# EAGLE design test (EAGLE 5.06)
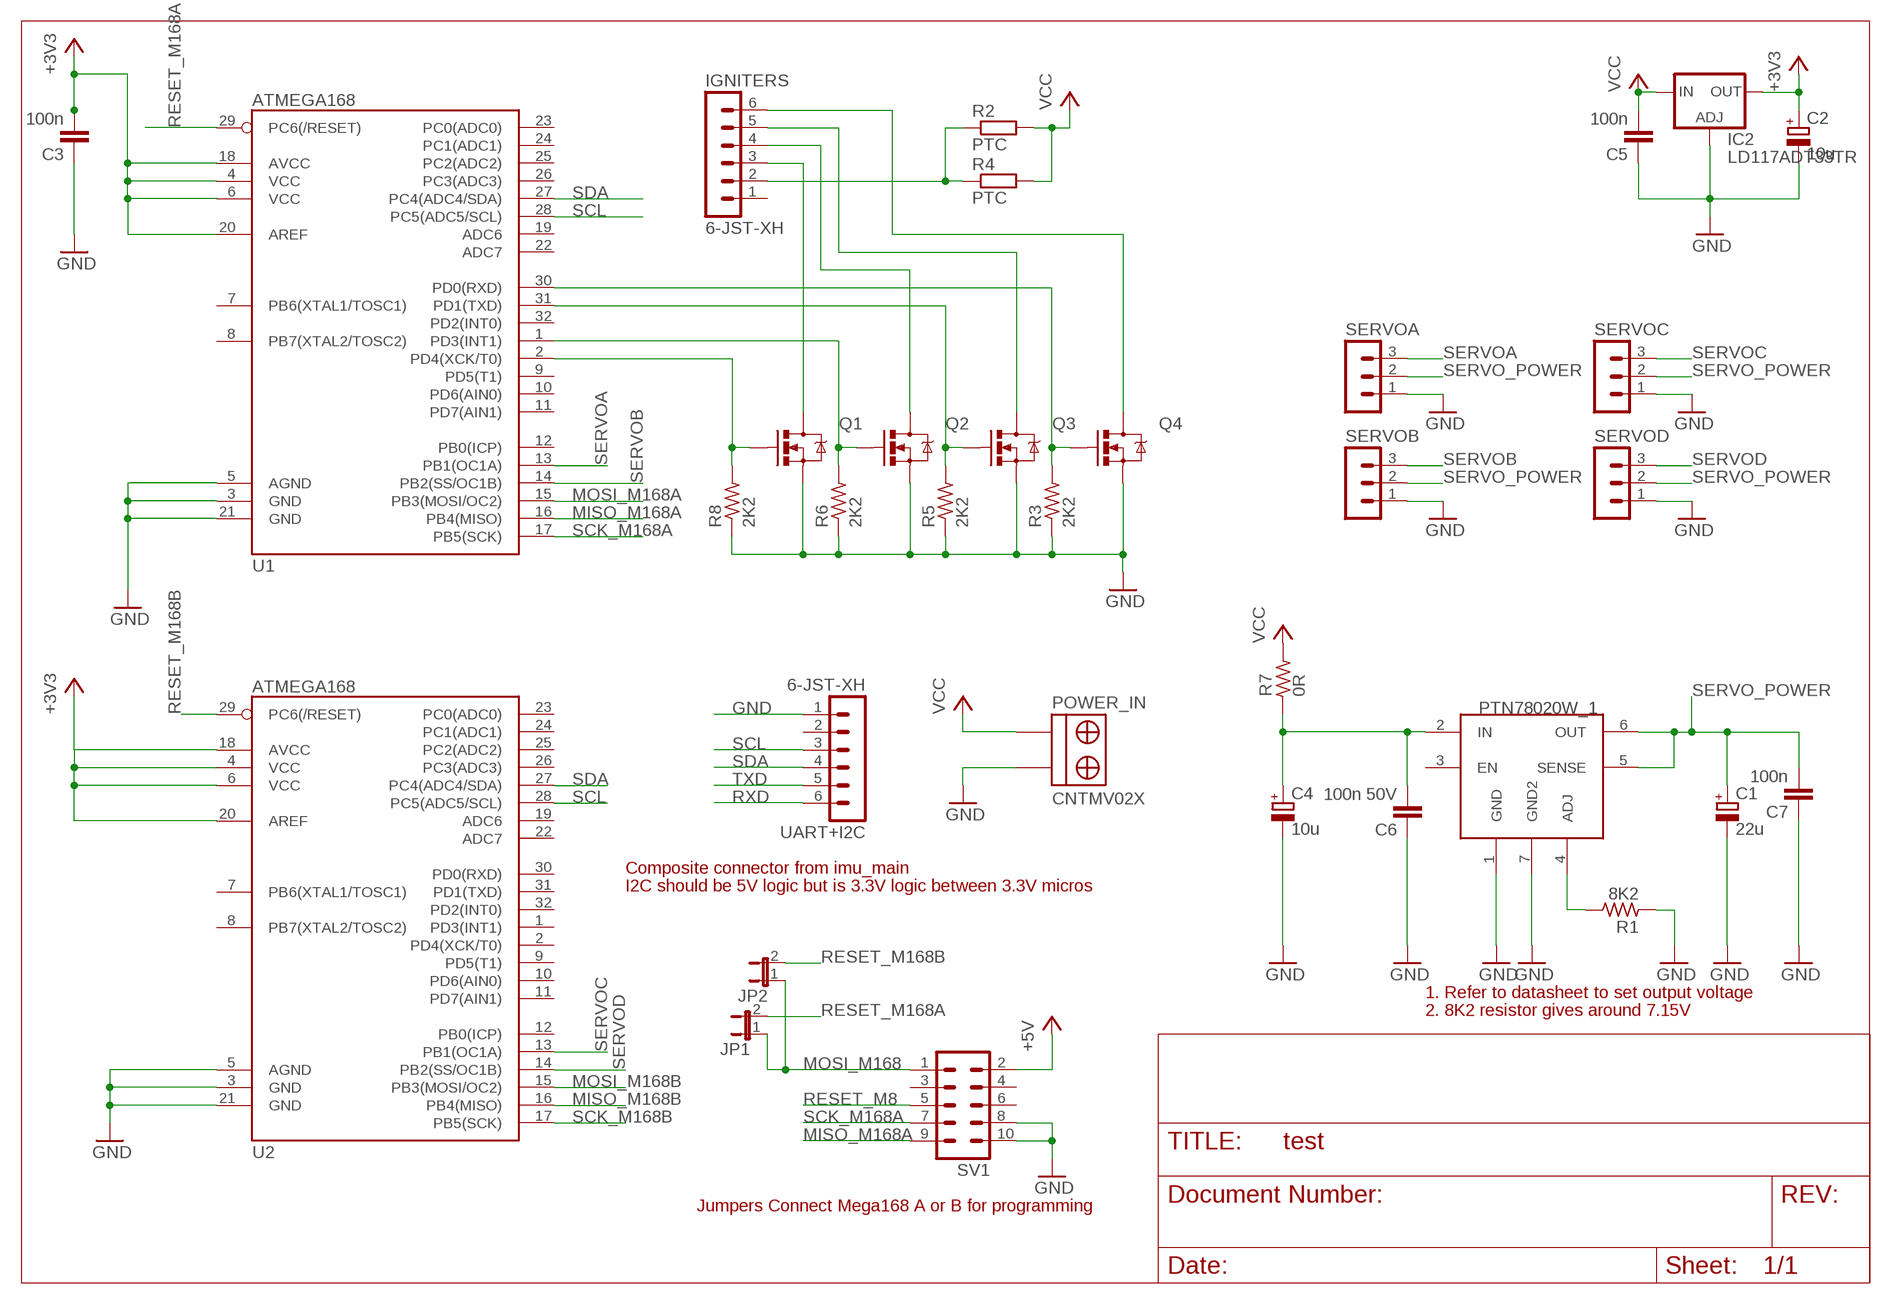
[diagram p0: schematic, sheet 1]

## Parts
C1  22u  CPOL-EUC/6032-28R  [C/6032-28R]
C2  10u  CPOL-EUC/6032-28R  [C/6032-28R]
C3  100n  C-EUC0805  [C0805]
C4  10u  CPOL-EUC/6032-28R  [C/6032-28R]
C5  100n  C-EUC0805  [C0805]
C6  100n 50V  C-EUC3216  [C3216]
C7  100n  C-EUC3216  [C3216]
IC2  LD117ADT33TR  [DPACK]
IGNITERS  6-JST-XH  [6]
JP1  JP1E  [JP1]
JP2  JP1E  [JP1]
POWER_IN  CNTMV02X  [CNTMV02X]
PTN78020W_1  PTN78020  [PTN78020]
Q1  MOSFET-NCHANNELSMD  [SOT23-3]
Q2  MOSFET-NCHANNELSMD  [SOT23-3]
Q3  MOSFET-NCHANNELSMD  [SOT23-3]
Q4  MOSFET-NCHANNELSMD  [SOT23-3]
R1  8K2  R_2012  [R2012]
R2  PTC  R-EU_R2512  [R2512]
R3  2K2  R-US_R0805  [R0805]
R4  PTC  R-EU_R2512  [R2512]
R5  2K2  R-US_R0805  [R0805]
R6  2K2  R-US_R0805  [R0805]
R7  0R  R_2512  [R2512]
R8  2K2  R-US_R0805  [R0805]
SERVOA  MA03-1  [MA03-1]
SERVOB  MA03-1  [MA03-1]
SERVOC  MA03-1  [MA03-1]
SERVOD  MA03-1  [MA03-1]
SV1  MA05-2LARGE_PAD  [MA05-2A]
U1  ATMEGA168  [TQFP32-08]
U2  ATMEGA168  [TQFP32-08]
UART+I2C  6-JST-XH  [6]

## Nets
+3V3: C2.+ C3.2 IC2.4(OUT) U1.4(VCC) U1.6(VCC) U1.18(AVCC) U1.20(AREF) U2.4(VCC) U2.6(VCC) U2.18(AVCC) U2.20(AREF)
+5V: SV1.2
GND: C1.- C2.- C3.1 C4.- C5.1 C6.1 C7.1 IC2.1(ADJ) POWER_IN.1(+) PTN78020W_1.1(GND) PTN78020W_1.7(GND2) Q1.2(S) Q2.2(S) Q3.2(S) Q4.2(S) R1.1 R3.1 R5.1 R6.1 R8.1 SERVOA.1 SERVOB.1 SERVOC.1 SERVOD.1 SV1.8 SV1.10 U1.3(GND) U1.5(AGND) U1.21(GND) U2.3(GND) U2.5(AGND) U2.21(GND) UART+I2C.1
MISO_M168A: SV1.9 U1.16(PB4(MISO))
MISO_M168B: U2.16(PB4(MISO))
MOSI_M168: JP1.1 JP2.1 SV1.1
MOSI_M168A: U1.15(PB3(MOSI/OC2))
MOSI_M168B: U2.15(PB3(MOSI/OC2))
N$1: IGNITERS.4 Q2.3(D)
N$2: IGNITERS.3 Q1.3(D)
N$3: IGNITERS.5 Q3.3(D)
N$4: IGNITERS.2 R2.1 R4.1
N$5: IGNITERS.6 Q4.3(D)
N$6: Q1.1(G) R8.2 U1.2(PD4(XCK/T0))
N$7: Q2.1(G) R6.2 U1.1(PD3(INT1))
N$8: Q3.1(G) R5.2 U1.31(PD1(TXD))
N$9: Q4.1(G) R3.2 U1.30(PD0(RXD))
N$10: PTN78020W_1.4(ADJ) R1.2
N$11: C4.+ C6.2 PTN78020W_1.2(IN) R7.1
RESET_M8: SV1.5
RESET_M168A: JP1.2 U1.29(PC6(/RESET))
RESET_M168B: JP2.2 U2.29(PC6(/RESET))
RXD: UART+I2C.6
SCK_M168A: SV1.7 U1.17(PB5(SCK))
SCK_M168B: U2.17(PB5(SCK))
SCL: U1.28(PC5(ADC5/SCL)) U2.28(PC5(ADC5/SCL)) UART+I2C.3
SDA: U1.27(PC4(ADC4/SDA)) U2.27(PC4(ADC4/SDA)) UART+I2C.4
SERVO_POWER: C1.+ C7.2 PTN78020W_1.5(SENSE) PTN78020W_1.6(OUT) SERVOA.2 SERVOB.2 SERVOC.2 SERVOD.2
SERVOA: SERVOA.3 U1.13(PB1(OC1A))
SERVOB: SERVOB.3 U1.14(PB2(SS/OC1B))
SERVOC: SERVOC.3 U2.13(PB1(OC1A))
SERVOD: SERVOD.3 U2.14(PB2(SS/OC1B))
TXD: UART+I2C.5
VCC: C5.2 IC2.3(IN) POWER_IN.2(-) R2.2 R4.2 R7.2
Unconnected: IGNITERS.1 PTN78020W_1.3(EN) SV1.3 SV1.4 SV1.6 U1.7(PB6(XTAL1/TOSC1)) U1.8(PB7(XTAL2/TOSC2)) U1.9(PD5(T1)) U1.10(PD6(AIN0)) U1.11(PD7(AIN1)) U1.12(PB0(ICP)) U1.19(ADC6) U1.22(ADC7) U1.23(PC0(ADC0)) U1.24(PC1(ADC1)) U1.25(PC2(ADC2)) U1.26(PC3(ADC3)) U1.32(PD2(INT0)) U2.1(PD3(INT1)) U2.2(PD4(XCK/T0)) U2.7(PB6(XTAL1/TOSC1)) U2.8(PB7(XTAL2/TOSC2)) U2.9(PD5(T1)) U2.10(PD6(AIN0)) U2.11(PD7(AIN1)) U2.12(PB0(ICP)) U2.19(ADC6) U2.22(ADC7) U2.23(PC0(ADC0)) U2.24(PC1(ADC1)) U2.25(PC2(ADC2)) U2.26(PC3(ADC3)) U2.30(PD0(RXD)) U2.31(PD1(TXD)) U2.32(PD2(INT0)) UART+I2C.2

## Notes on the sheet
- Composite connector from imu_main
- I2C should be 5V logic but is 3.3V logic between 3.3V micros
- 1. Refer to datasheet to set output voltage
- 2. 8K2 resistor gives around 7.15V
- Jumpers Connect Mega168 A or B for programming

## Library data of the parts
C1 C2 C4 = rcl:CPOL-EU: POLARIZED CAPACITOR, European symbol
C3 C5-C7 = rcl:C-EU: CAPACITOR, European symbol
IC2 = v-reg:LD117A?*: Low drop fixed and adjustable positive voltage regulators 1 A Source: http://www.st.com/stonline/products/literature/ds/7194/ld1117axx.pdf
IGNITERS UART+I2C = con-jst-xh:6-JST-XH
JP1 JP2 = jumper:JP1E: JUMPER
POWER_IN = robert-custom:CNTMV02X
PTN78020W_1 = robert-custom:PTN78020
Q1-Q4 = SparkFun:MOSFET-NCHANNEL
R1 R7 = rc-master-smd:R_: RESISTOR
R2 R4 = rcl:R-EU_: RESISTOR, European symbol
R3 R5 R6 R8 = rcl:R-US_: RESISTOR, American symbol
SERVOA SERVOB SERVOC SERVOD = con-lstb:MA03-1: PIN HEADER
SV1 = con-lstb:MA05-2: PIN HEADER
U1 U2 = SparkFun:ATMEGA168

## Board
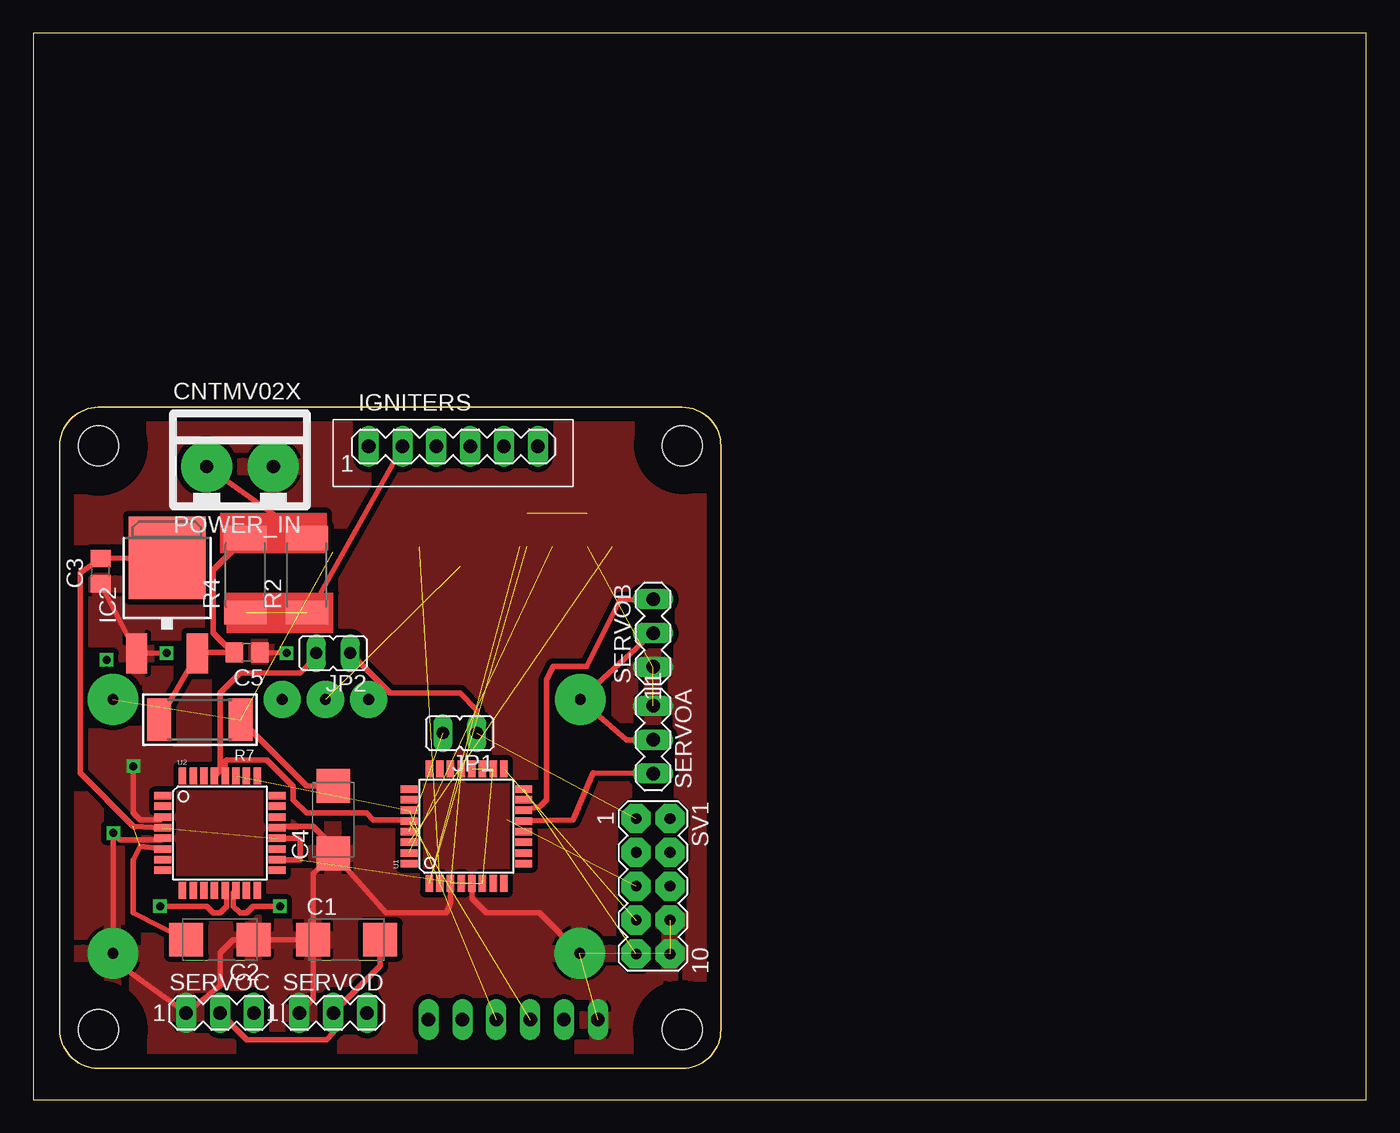
[diagram p1: board, top side]
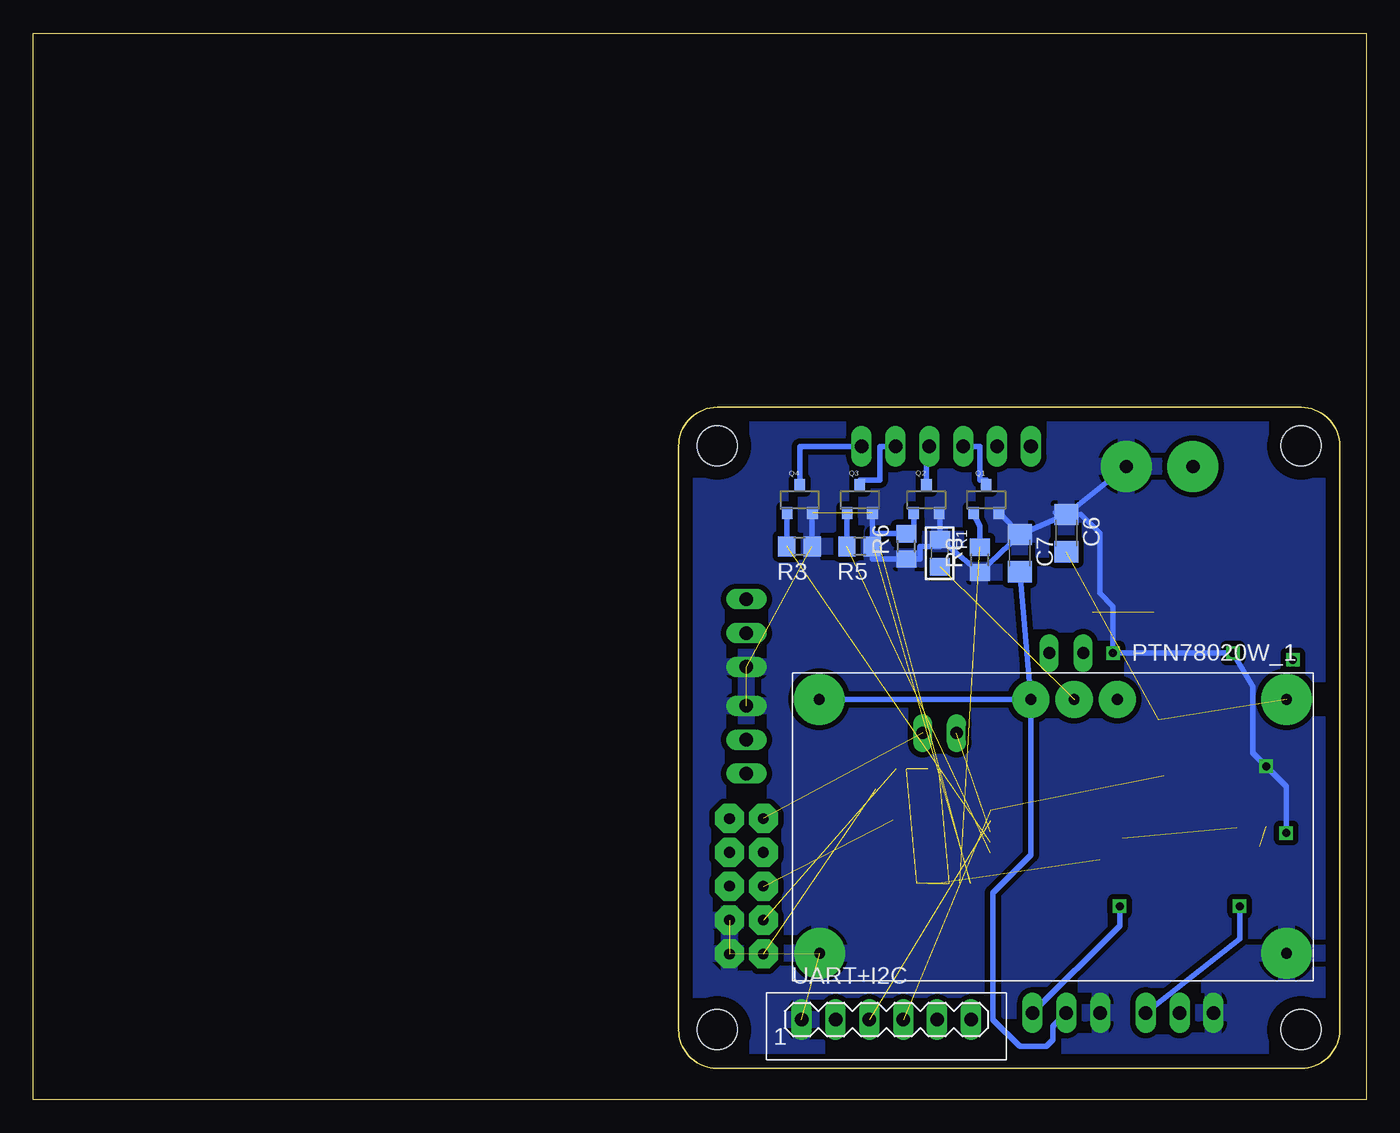
[diagram p2: board, bottom side, seen from below]

Size 100 x 80 mm. Coordinates in mm from the lower left corner, seen from the top.
Outline: 0,0 100,0 100,80 0,80 0,0
Outline: 1.99,5.24 1.99,49.04 arc-90 4.89,51.94 48.69,51.94 arc-90 51.59,49.04 51.59,5.24 arc-90 48.69,2.34 4.89,2.34 arc-90 1.99,5.24
Copper layers (1*16): Top 0.035mm / dielectric 1.5mm / Bottom 0.035mm
Design rules "default": minimum track width 10mil, minimum drill 24mil, track to track 8mil, track to pad 8mil, pad to pad 8mil, via to via 8mil, smd to smd 8mil, copper to edge 40mil, drill to drill 8mil, minimum pad ring 10mil, minimum via ring 8mil, stop-mask expansion 4mil, vias tented up to drill 0mil, thermal gap 10mil
Holes 3 mm at 4.89,49.04 48.69,49.04 4.89,5.24 48.69,5.24
tRestrict: area 1.8,45.9 to 8,52.1; area 45.7,46 to 51.9,52.2; area 45.6,2.1 to 51.8,8.3; area 1.8,2.1 to 8,8.3

### Footprints (pad centres in the part's own frame; a part is rotated, then mirrored left to right if it is on the bottom)
C/6032-28R = smd 2.55 x 2.5: + 2.525,0; - -2.525,0
C0805 = smd 1.3 x 1.5: 1 -0.95,0; 2 0.95,0
C3216 = smd 1.6 x 1.8: 1 -1.4,0; 2 1.4,0
DPACK = smd 1.6 x 3: 1 -2.28,-4.8; 3 2.28,-4.8 | smd 5.8 x 6.2: 4 0,2.38
6 = drill 1.016 long: 1 -6.35,0; 2 -3.81,0; 3 -1.27,0; 4 1.27,0; 5 3.81,0; 6 6.35,0
JP1 = drill 0.914 long: 1 0,-1.27; 2 0,1.27
CNTMV02X = drill 1 pad 3.81 round: 1 2.5,0; 2 -2.5,0
PTN78020 = drill 0.8 pad 3.81 round: 1 -17.526,9.525; 2 -17.526,-9.525; 6 17.531,-9.525; 7 17.499,9.525 | drill 0.8 pad 2.794 round: 3 -4.831,-9.525; 4 -1.587,-9.525; 5 1.656,-9.525
SOT23-3 = smd 0.8 x 0.9: 1 -0.95,-1; 2 0.95,-1; 3 0,1.1
R2012 = smd 1.3 x 1.5: 1 -1.016,0; 2 1.016,0
R2512 = smd 1.8 x 3.2: 1 -2.8,0; 2 2.8,0
R0805 = smd 1.3 x 1.5: 1 -0.95,0; 2 0.95,0
R2512' = smd 1.8 x 3.2: 1 -3.048,0; 2 3.048,0
MA03-1 = drill 1.016 long: 1 -2.54,0; 2 0,0; 3 2.54,0
MA05-2A = drill 0.8 pad 2.184 octagon: 1 -5.08,-1.27; 2 -5.08,1.27; 3 -2.54,-1.27; 4 -2.54,1.27; 5 0,-1.27; 6 0,1.27; 7 2.54,-1.27; 8 2.54,1.27; 9 5.08,-1.27; 10 5.08,1.27
TQFP32-08 = smd 1.27 x 0.559: 1 -4.293,2.8; 2 -4.293,2; 3 -4.293,1.2; 4 -4.293,0.4; 5 -4.293,-0.4; 6 -4.293,-1.2; 7 -4.293,-2; 8 -4.293,-2.8; 17 4.293,-2.8; 18 4.293,-2; 19 4.293,-1.2; 20 4.293,-0.4; 21 4.293,0.4; 22 4.293,1.2; 23 4.293,2; 24 4.293,2.8 | smd 0.559 x 1.27: 9 -2.8,-4.293; 10 -2,-4.293; 11 -1.2,-4.293; 12 -0.4,-4.293; 13 0.4,-4.293; 14 1.2,-4.293; 15 2,-4.293; 16 2.8,-4.293; 25 2.8,4.293; 26 2,4.293; 27 1.2,4.293; 28 0.4,4.293; 29 -0.4,4.293; 30 -1.2,4.293; 31 -2,4.293; 32 -2.8,4.293

### Placement (x,y rotation side)
C1  23.5,12 0 top
C2  14,12 180 top
C3  5.04,39.64 90 top
C4  22.5,21 90 top
C5  16.04,33.55 180 top
C6  22.5,42.5 270 bottom
C7  26,41 270 bottom
IC2  10.04,38.28 0 top
IGNITERS  31.51,49 0 top
JP1  32,27.5 90 top
JP2  22.5,33.5 90 top
POWER_IN  15.5,47.5 0 top
PTN78020W_1  23.5,20.5 180 bottom
Q1  28.51,45 0 bottom
Q2  32.99,45 0 bottom
Q3  37.99,45 0 bottom
Q4  42.5,45 0 bottom
R1  32,41 270 bottom
R2  20.53,39.34 90 top
R3  42.52,41.5 180 bottom
R4  15.92,39.34 90 top
R5  38,41.51 180 bottom
R6  34.5,41.51 90 bottom
R7  0R  [R2512']  12.5,28.5 180 top
R8  28.99,40.5 90 bottom
SERVOA  46.5,27 270 top
SERVOB  46.5,35 90 top
SERVOC  14,6.5 0 top
SERVOD  22.5,6.5 0 top
SV1  46.5,16 270 top
U1  32.5,20.5 90 top
U2  14,20 0 top
UART+I2C  36,6 0 bottom

### Tracks (layer width: path | path; a pad name or v marks a point on that pad's centre or on a via)
+3V3  (6 unrouted)
  Top 0.406: U2.6 8,19 7.5,18 7.5,14 C2.+ | U2.4 7.5,20.5 3.5,24.5 3.5,39.5 C3.2 IC2.4 8,39 | U2.18 20,18 20,19.5 19.9,19.6 U2.20
GND  (via drill 0.6)  (11 unrouted)
  Top 0.406: C3.1 IC2.1 10,33.5 | C5.1 19,33.5 | U2.3 9.51,21 8,21 7.5,21.5 v7.5,25 | U2.5 9.61,19.5 6.5,19.5 6,20 6,11 PTN78020W_1.1 5.97,10.49 SERVOC.1 14,8.54 14,11 15,12 16.5,12 | 16.5,12 C2.- | 16.5,12 C1.- | C4.- 20.98,16.95 C1.- | U2.21 18.39,20.5 21,20.5 22.5,19 C4.- | C4.- 26.48,14 31,14 31.3,14.8 U1.3 | PTN78020W_1.7 37.97,14 34,14 32.9,15.1 U1.5 | SERVOD.1 20.98,7.51 C1.-
  Bottom 0.406: Q1.2 27.5,44 C7.1 | Q4.2 41.57,43.99 R3.1 | Q3.2 37.05,44 R5.1 37.05,40.56 R6.1 33.5,40.56 33.5,41.5 32,41.5 R1.1 | Q2.2 32,44 R1.1 | C6.1 C7.1 | C6.1 POWER_IN.1 | R1.1 R8.1 C7.1 | C6.1 23.31,44.05 | 6,20 6,23.5 v7.5,25 8.5,26 8.5,31 10,33.5 19,33.5 19,37 20,38 20,42.5 21.4,43.9 C6.1
  pour Top (isolate 0.406): 2.5,3 51,3 51,51.5 2.5,51.5
  pour Bottom (isolate 0.406): 3,3 51,3 51,51.5 2.5,51.5 2.5,3
MISO_M168A  (1 unrouted)
MOSI_M168  (1 unrouted)
  Top 0.406: JP2.1 26.77,30.5 32,30.5 33.27,29.23 JP1.1
N$1
  Bottom 0.406: IGNITERS.4 32.99,49 Q2.3
N$2
  Bottom 0.406: IGNITERS.3 29,49 29,46.5 28.5,46.5 Q1.3
N$3
  Bottom 0.406: IGNITERS.5 36.5,49 36.5,46.5 37.99,46.5 Q3.3
N$4  (1 unrouted)
  Top 0.406: R2.1 21,37 IGNITERS.2
N$5
  Bottom 0.406: IGNITERS.6 42.5,49 Q4.3
N$6  (1 unrouted)
  Bottom 0.406: R8.2 29,43 Q1.1
N$7  (2 unrouted)
  Bottom 0.406: Q2.1 33.94,42.46 R6.2 37,42.46 37,41.5
N$8  (1 unrouted)
  Bottom 0.406: Q3.1 38.95,44 R5.2
N$9  (1 unrouted)
  Bottom 0.406: Q4.1 43.47,43.99 R3.2
N$10  (1 unrouted)
N$11  (2 unrouted)
  Top 0.406: R7.1 20.52,23.52 C4.+
N$16  (via drill 0.6)
  other vias: 19,33.5
N$19  (via drill 0.6)
  other vias: 10,33.5
N$20  (via drill 0.6)
  other vias: 5.5,33
N$22  (via drill 0.6)
  other vias: 6,20
RESET_M8  (1 unrouted)
RESET_M168A  (1 unrouted)
RESET_M168B
  Top 0.406: U2.29 14,24.69 14,30.5 15.5,32 20,32 21.23,33.23 JP2.2
SCK_M168A  (1 unrouted)
SCL  (1 unrouted)
  Top 0.406: U1.28 28.11,21 25.5,21 25,21.5 20.5,21.5 19.5,22.5 19.5,23.5 17.5,25.5 14.5,25.5 14.4,25.4 U2.28
SDA  (2 unrouted)
SERVO_POWER
  Top 0.406: SERVOA.2 44.5,27 PTN78020W_1.6 SERVOB.2 | SERVOC.2 16,4.5 22,4.5 22.5,5 SERVOD.2 26.02,10.03 C1.+
  Bottom 0.406: PTN78020W_1.5 C7.2 | PTN78020W_1.5 PTN78020W_1.6 | SERVOD.2 23.5,5.5 23.5,4.5 24,4 26,4 28,6 28,15.5 25.16,18.34 PTN78020W_1.5
SERVOA
  Top 0.406: U1.13 40.5,21 42,24.5 SERVOA.3
SERVOB
  Top 0.406: U1.14 38,22 38.5,22.5 38.5,31.5 39,32.5 41.5,32.5 44,37.5 SERVOB.3
SERVOC  (via drill 0.6)
  Top 0.406: U2.13 14.5,15.61 14.5,14.5 14,14 13.5,14 13,14.5 v9.5,14.5
  Bottom 0.406: SERVOC.3 9.5,12.04 v9.5,14.5
SERVOD  (via drill 0.6)
  Top 0.406: U2.14 15,15.51 15,14.5 15.5,14 16,14 16.5,14.5 v18.5,14.5
  Bottom 0.406: SERVOD.3 18.5,13.04 v18.5,14.5
VCC
  Top 0.406: POWER_IN.2 R2.2 20.5,42 R4.2 13.5,39.72 13.5,35 14.95,33.55 C5.2 12.39,33.55 IC2.3 R7.2
(copper drawn outside any net)
  shapes: Top area x2